# Altium project Sensors_PCB.PrjPcb
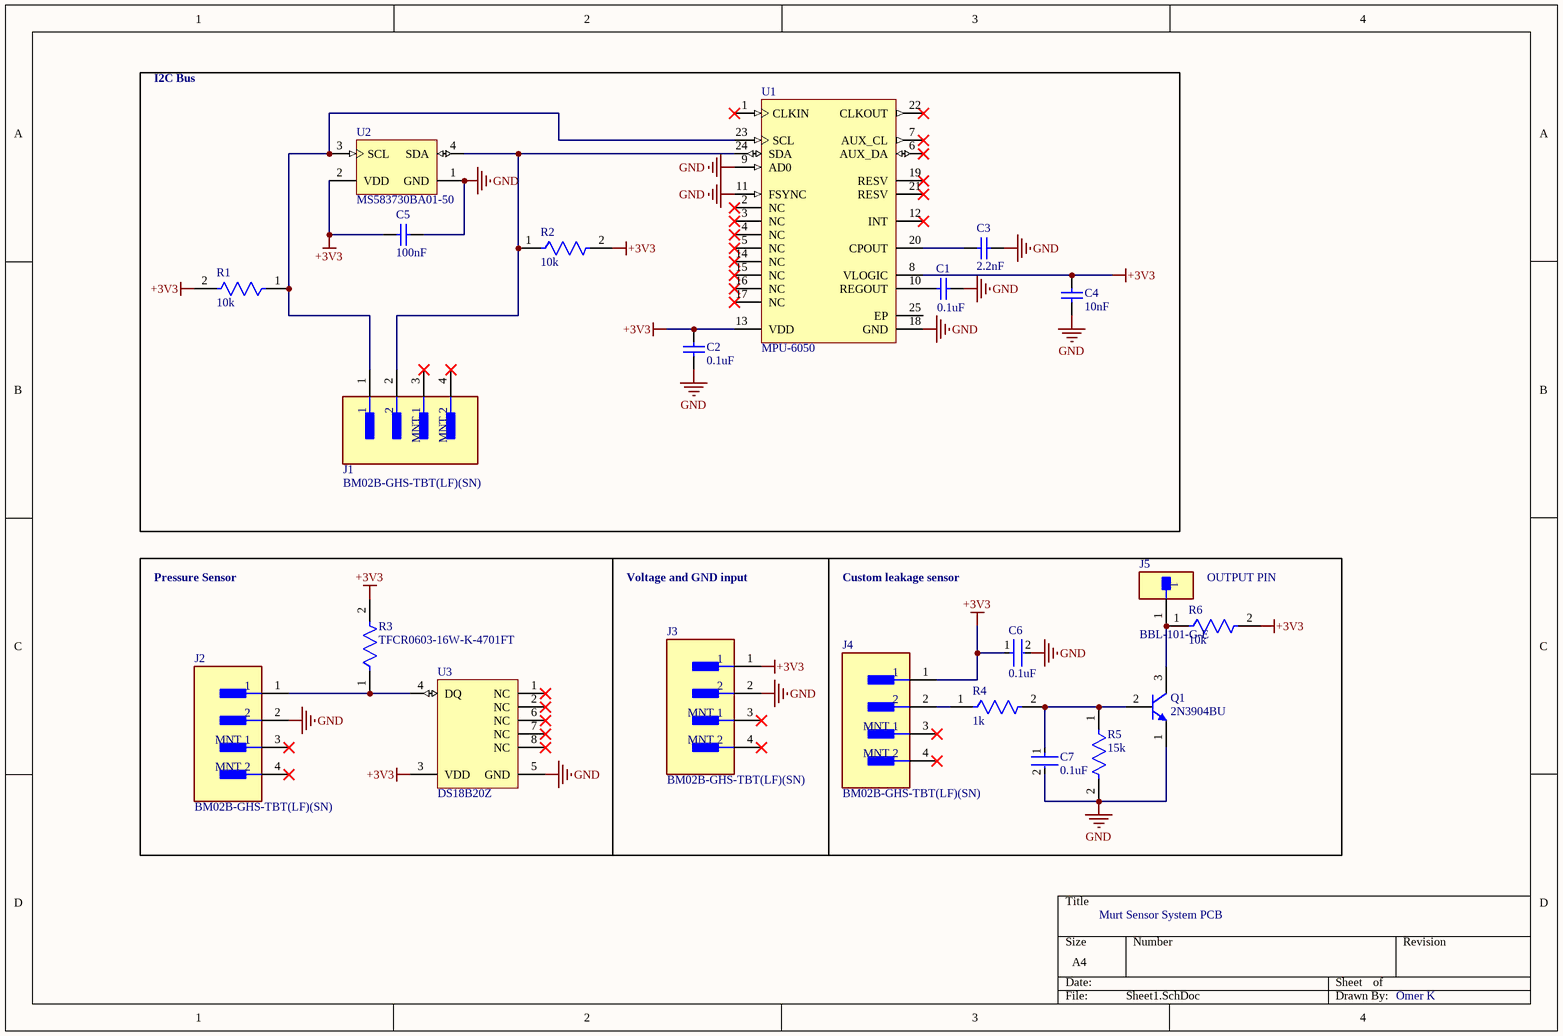
[diagram p0: Sheet1.SchDoc]
1 sheet, 22 parts. Net scope: global (net labels, ports and power ports of the same name join across sheets).
Board file: PCB1.PcbDoc

## Sheet Sheet1.SchDoc
size A4; SheetNumber: 1; SheetTotal: 1

### Parts
C1  0.1uF  [CAPC2013X145X50ML20T20]
C2  0.1uF  [CAPC2013X145X50ML20T20]
C3  2.2nF  [CAPC2013X145X50LL20T20]
C4  10nF  [CAPC2013X145X50LL20T20]
C5  100nF  [CAPC2013X145X50ML20T20]
C6  0.1uF  [FP-CC0402-MFG]
C7  0.1uF  [FP-CC0402-MFG]
J1  BM02B-GHS-TBT(LF)(SN)  [FP-BM02B-GHS-TBT_LF_SN-MFG]
J2  BM02B-GHS-TBT(LF)(SN)  [FP-BM02B-GHS-TBT_LF_SN-MFG]
J3  BM02B-GHS-TBT(LF)(SN)  [FP-BM02B-GHS-TBT_LF_SN-MFG]
J4  BM02B-GHS-TBT(LF)(SN)  [FP-BM02B-GHS-TBT_LF_SN-MFG]
J5  BBL-101-G-E  [FP-BBL-101-G-E-MFG]
Q1  2N3904BU  [FAIR-TO-92]
R1  10k  [FP-AC0603-MFG]
R2  10k  [FP-AC0603-MFG]
R3  TFCR0603-16W-K-4701FT  [FP-TFCR0603-IPC_C]
R4  1k  [FP-TFCR0805-IPC_A]
R5  15k  [FP-CRGCQ0805-IPC_C]
R6  10k  [FP-CRGCQ0805-IPC_C]
U1  MPU-6050  [IS-QFN-24_V]
U2  MS583730BA01-50  [TECO-MS583730BA01-50_V]
U3  DS18B20Z  [MAXM-S8-2_N]

### Blocks framed on the sheet
I2C Bus: C1-C5 J1 R1 R2 U1 U2
Pressure Sensor: J2 R3 U3
Voltage and GND input: J3

### Nets
+3V3: C2.1 C4.1 C5.1 C6.1 J3.1 J4.1 R1.2 R2.2 R3.2 R6.2 U1.8(VLOGIC) U1.13(VDD) U2.2(VDD) U3.3(VDD)
GND: C1.2 C2.2 C3.2 C4.2 C5.2 C6.2 C7.2 J2.2 J3.2 Q1.1(E) R5.2 U1.9(AD0) U1.11(FSYNC) U1.18(GND) U2.1(GND) U3.5(GND)
NetC1_1: C1.1 U1.10(REGOUT)
NetC3_1: C3.1 U1.20(CPOUT)
NetC7_1: C7.1 Q1.2(B) R4.2 R5.1
NetJ1_1: J1.1 R1.1 U1.23(SCL) U2.3(SCL)
NetJ1_2: J1.2 R2.1 U1.24(SDA) U2.4(SDA)
NetJ2_1: J2.1 R3.1 U3.4(DQ)
NetJ4_2: J4.2 R4.1
NetJ5_1: J5.1 Q1.3(C) R6.1

Not connected (* = marked no-connect by the designer): J1 3(MNT_1)* 4(MNT_2)*; J2 3(MNT_1)* 4(MNT_2)*; J3 3(MNT_1)* 4(MNT_2)*; J4 3(MNT_1)* 4(MNT_2)*; U1 1(CLKIN)* 2(NC)* 3(NC)* 4(NC)* 5(NC)* 6(AUX_DA)* 7(AUX_CL)* 12(INT)* 14(NC)* 15(NC)* 16(NC)* 17(NC)* 19(RESV)* 21(RESV)* 22(CLKOUT)* 25(EP); U3 1(NC)* 2(NC)* 6(NC)* 7(NC)* 8(NC)*

### Notes on the sheet
- Custom leakage sensor
- OUTPUT PIN
- Murt Sensor System PCB
- Omer K

### Library data of the parts
C1 C2 C5 = CMP-2007-01444-1: Manufacturer: Vitramon; Part Number: VJ0805Y104KXQCW1BC
C3 = CMP-2007-01454-1: Part Number: VJ0805Y222KXQCW1BC; Manufacturer: Vitramon
C4 = CMP-1036-03809-2: Part Number: VJ0805Y103KXQPW1BC; Manufacturer: Vitramon
C6 C7 = CMP-03422-000490-1: CAP CER 0.1UF 6.3V X7R 0402; Manufacturer: YAGEO; Manufacturer Part Number: CC0402KRX7R5BB104; Temperature Coefficient: 30ppm/°C; Capacitance: 100 nF; Tolerance: 0.1; Material: Ceramic; Automotive Grade: NA; Value: 100 nF; Package: CC0402; RoHS: TRUE; Temperature Range High: +125°C; Device Class L1: Passive Components; Octopart: https://octopart.com/cc0402krx7r5bb104-yageo-57080752; ComponentLink2URL: http://www.yageo.com/documents/recent/UPY-GP_NP0_16V-to-50V_16.pdf; Automotive: No; Digikey Description: CAP CER 0.1UF 6.3V X7R 0402; ComponentLink2Description: Datasheet; Footprint Url: http://www.yageo.com/exep/pages/download/literatures/UPY-C_GEN_24.pdf; Ipc Land Pattern Name: CAPC10050X50; Mouser Description: 0402 0.1 uF 6.3 V ±10% Tolerance X7R Multilayer Ceramic Capacitor; Category: Cap; Lead Free: Yes; Device Class L3: Ceramic Capacitors; Temperature Characteristic: X7R; Temperature: -55°C to +125°C; Height: 0.55mm; Device Class L2: Capacitors; Temperature Range Low: -55°C; Voltage Rating: 6.3 V
J1-J4 = CMP-17439-000221-2: CONN HEADER SMD 2POS 1.25MM; NexarPartId: 289277; Current Rating: 1A; Number of Positions: 2; Voltage Rating: 50V; Wire/Cable Gauge: 26AWG; Voltage Rating (AC): 50V; Number of Rows: 1; Housing Color: Natural; Pitch: 1.25mm; Contact Material: Copper, Tin; Number of Contacts: 2; REACH SVHC: No SVHC; Min Operating Temperature: -25°C; Housing Material: Nylon; Contact Plating: Tin; Termination: SMD/SMT; Orientation: Straight; Packaging: Cut Tape; RoHS: Compliant; Height: 4.05mm; Lead Free: Lead Free; Lead Pitch: 1.25mm; Max Operating Temperature: 85°C
J5 = CMP-00575-00271154-1: BBL-101-G-E Conn Unshrouded Header HDR 1 POS Solder ST Top Entry Thru-Hole Bulk; NexarPartId: 271154; Manufacturer Lifecycle Status: PRODUCTION; Number of Positions: 1; Gender: Male; Lead Free: Lead Free; Mount: Through Hole; Max Operating Temperature: 125°C; Lifecycle Status: Production; Housing Material: Polyester; Length: 2.54mm; Orientation: Straight; Contact Mating Length: 2.667mm; Depth: 2.54mm; Number of Rows: 1; Housing Color: Black; Termination: Solder; Number of Contacts: 1; Contact Material: Brass, Bronze, Gold; REACH SVHC: No SVHC; Height: 4.572mm; Width: 2.54mm; RoHS: Compliant; Contact Plating: Gold; Min Operating Temperature: -55°C; Color: Black; Radiation Hardening: No
Q1 = CMP-2000-04944-1: NPN General-Purpose Amplifier, 40 V VCEO, 0.2 A, -55 to 150 degC, 2-Pin TO-92, RoHS, Bulk; Manufacturer: FairchildSemiconductor; Maximum Collector Base Voltage: 60V; Minimum DC Current Gain: 40@0.1mA@1V; Maximum Collector Emitter Voltage: 40V; Maximum DC Collector Current: 0.2A; Rad Hard: No; Maximum Operating Frequency: 300(Min)MHz; Maximum Collector Emitter Saturation Voltage: 0.2@1mA@10mA; Maximum Power Dissipation: 625mW; Package Description: 3-Pin Transistor Outline Package, Body Dia 4.79 mm, Pitch 1.27 mm; Package Reference: TO-92; Pin Count: 3; Operating Temperature: -55to150degC; Category: GPBJT; Manufacturer URL: https://www.fairchildsemi.com/; Datasheet URL: https://datasheet.ciiva.com/4722/2n3904-82270-4722369.pdf; Package: 3TO-92; Packaging: Bulk; Type: NPN; Datasheet Version: Rev. 1.1.0, 10/2014; Mounting: ThroughHole
R1 R2 = CMP-03412-038553-1: RES 10kΩ 1.00% 0.2W 0603
R3 = CMP-250906-196530-1: RES Thin Film,  4.7kΩ, 1%, 0.1W, 100ppm/°C, 0603
R4 = CMP-250906-148809-1: RES Thin Film,  1kΩ, 0.1%, 0.1W, 25ppm/°C, 0805
R5 = CMP-03211-008083-1: CRGCQ 0805 15K 1%; Manufacturer Part Number: CRGCQ0805F15K; Manufacturer: TE Connectivity; Voltage Rating: 150V; Tolerance: 0.01; Power Rating: 0.125W; Resistance: 15KΩ; Temperature Coefficient: ±100ppm/°C; Automotive Grade: Grade 949; Value: 15KΩ; Temperature Range High: +155°C; Device Class L2: Resistors; Temperature: -55°C to +155°C; RoHS: TRUE; ComponentLink2Description: Datasheet; Package: CRGCQ0805; Category: Res; Temperature Range Low: -55°C; Automotive: Yes; ComponentLink2URL: https://www.te.com/commerce/DocumentDelivery/DDEController?Action=showdoc&DocId=Data+Sheet%7F1773204-3%7F1%7Fpdf%7FEnglish%7FENG_DS_1773204-3_1.pdf%7F4-2176341-958; Composition: Thick Film; Device Class L3: Chip SMD Resistors; Device Class L1: Passive Components; Digikey Description: CRGCQ 0805 15K 1%; Ambient Temperature Range High: +70°C; Ipc Land Pattern Name: RESC200125X55; Lead Free: Yes; Height: 0.65mm; Octopart: https://octopart.com/crgcq0805f15k-te+connectivity-91018148; Series: CRGCQ
R6 = CMP-03211-002989-1: CRGCQ 0805 10K 5%; Manufacturer Part Number: CRGCQ0805J10K; Manufacturer: TE Connectivity; Voltage Rating: 150V; Temperature Coefficient: ±100ppm/°C; Resistance: 10KΩ; Value: 10KΩ; Power Rating: 0.125W; Tolerance: 0.05; Automotive Grade: Grade 914; Height: 0.65mm; Lead Free: Yes; Temperature Range High: +155°C; Composition: Thick Film; Temperature Range Low: -55°C; Ambient Temperature Range High: +70°C; Temperature: -55°C to +155°C; Package: CRGCQ0805; Device Class L2: Resistors; RoHS: TRUE; ComponentLink2URL: https://www.te.com/commerce/DocumentDelivery/DDEController?Action=showdoc&DocId=Data+Sheet%7F1773204-3%7F1%7Fpdf%7FEnglish%7FENG_DS_1773204-3_1.pdf%7F4-2176341-923; Series: CRGCQ; Device Class L1: Passive Components; Ipc Land Pattern Name: RESC200125X55; ComponentLink2Description: Datasheet; Category: Res; Digikey Description: CRGCQ 0805 10K 5%; Mouser Description: Res Thick Film 0805 10K Ohm 5% 0.125W(1/8W) ±100ppm/C Pad SMD Automotive T/R; Automotive: Yes; Octopart: https://octopart.com/crgcq0805j10k-te+connectivity-91018201; Device Class L3: Chip SMD Resistors
U1 = CMP-1753-00002-2: 3-Axis Gyroscope, Accelerometer and a Digital Motion Processor(TM) (DMP), 2.375 to 3.46 V, -40 to 85 degC, 24-Pin QFN, RoHS, Tape and Reel; Manufacturer: InvenSense; Featured Product: MPU-60506-Axis,IntegratedI²CSolution; Other Names: 1428-1007-2 / MPU6050; Sensor Type: MotionTracking; Online Catalog: MPU-6000™Series; Unit PriceUSD: Digital; Datasheet Version: Rev. 3.3, 05/2012; Category: Sensors,Transducers; Datasheet URL: http://datasheet.octopart.com/MPU-6050-InvenSense-datasheet-14421344.pdf; Family: Multifunction; Standard Package: 5,000; Manufacturer URL: http://www.invensense.com/; Output Type: Digital; Dynamic Catalog: MPU-6000™Series
U2 = CMP-1684-00024-1: Ultra Small Gel Filled Pressure Sensor, 1.5 to 3.6 V, -20 to 85 degC, 4-Pin SMD, RoHS, Tape and Reel; Manufacturer: TE Connectivity; Datasheet URL: http://www.te.com/commerce/DocumentDelivery/DDEController?Action=srchrtrv&DocNm=MS5837-30BA&DocType=Data+Sheet&DocLang=English; Manufacturer URL: http://www.te.com; Mounting Technology: SurfaceMount; Package Reference: SMD; Package Description: 4-Pin Surface Mount Device, Body 3.3 x 3.3 mm, Pitch 2 mm
U3 = CMP-0253-00023-2: High-Precision 1-Wire Digital Thermometer, -55 to 125 degC, 8-Pin SOIC (S8-2); Parasite Pwr.: Yes; Temp. Thresh.: Programmable (NV); Sensor Type: Local; Code_JEDEC: MS012; Mounting Technology: Surface Mount; ComponentLink3Description: Package Specification; PartNumber: DS18B20Z; ComponentLink2Description: Datasheet; ComponentLink3URL: http://pdfserv.maximintegrated.com/package_dwgs/21-0041.PDF; PackageVersion: Rev. D, 10/2012; ComponentLink1URL: http://www.maximintegrated.com/; Multi Droppable: Yes; ComponentLink1Description: Manufacturer URL; ComponentLink2URL: http://datasheets.maximintegrated.com/en/ds/DS18B20.pdf; Generic Part Number: DS18B20; PackageReference: S8-2; PackageDescription: 8-Pin Small-Outline IC, Narrow (0.15in) (S8-2), Body 4.90 x 3.90 mm, Pitch 1.27 mm; Interface: 1-Wire; DatasheetVersion: Rev. 4